# EAGLE design Micro (EAGLE 8.0.0)
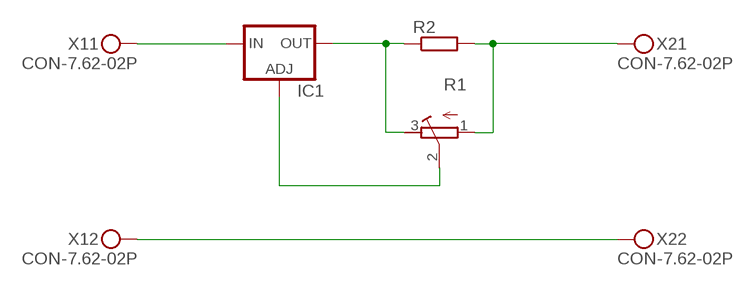
[diagram p0: schematic, sheet 1]

## Parts
IC1  LM350T  [317TS]
R1  R_POTE  [EVUE]
R2  R_SQP-5  [SQP-5]
X1  CON-7.62-02P  [KF25C-7.62-02P-13]
X2  CON-7.62-02P  [KF25C-7.62-02P-13]

## Nets
N$1: IC1.2(OUT) R1.3(E) R2.1
N$2: R1.1(A) R2.2 X2.P$1
N$3: IC1.1(ADJ) R1.2(S)
N$4: X1.P$2 X2.P$2
N$5: IC1.3(IN) X1.P$1

## Library data of the parts
IC1 = Namenlos:LM350T: VOLTAGE REGULATOR
R1 = Namenlos:R_POT
R2 = Namenlos:R_
X1 X2 = Namenlos:CON-7.62-02P

## Board
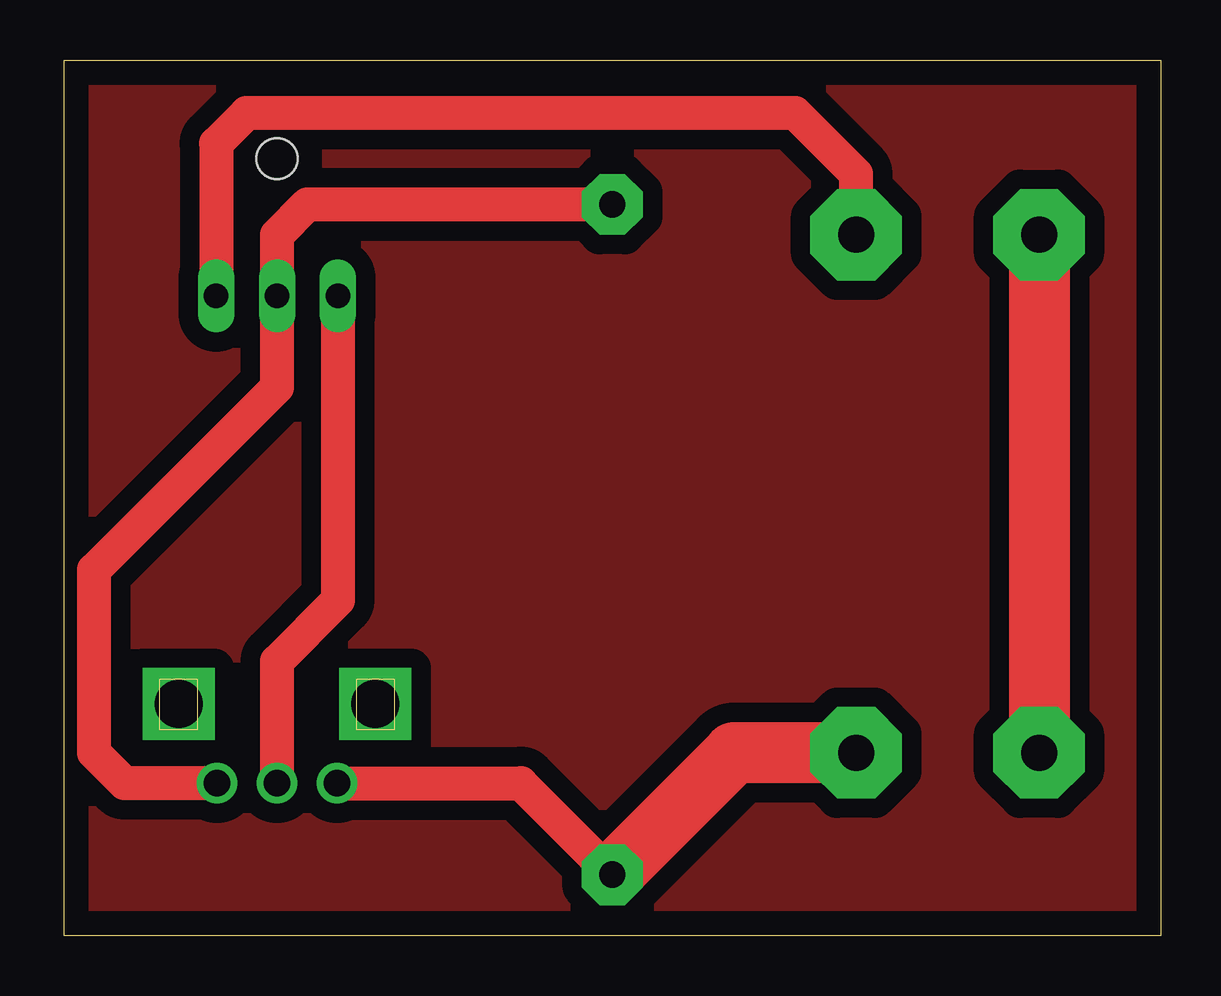
[diagram p1: board, top side]
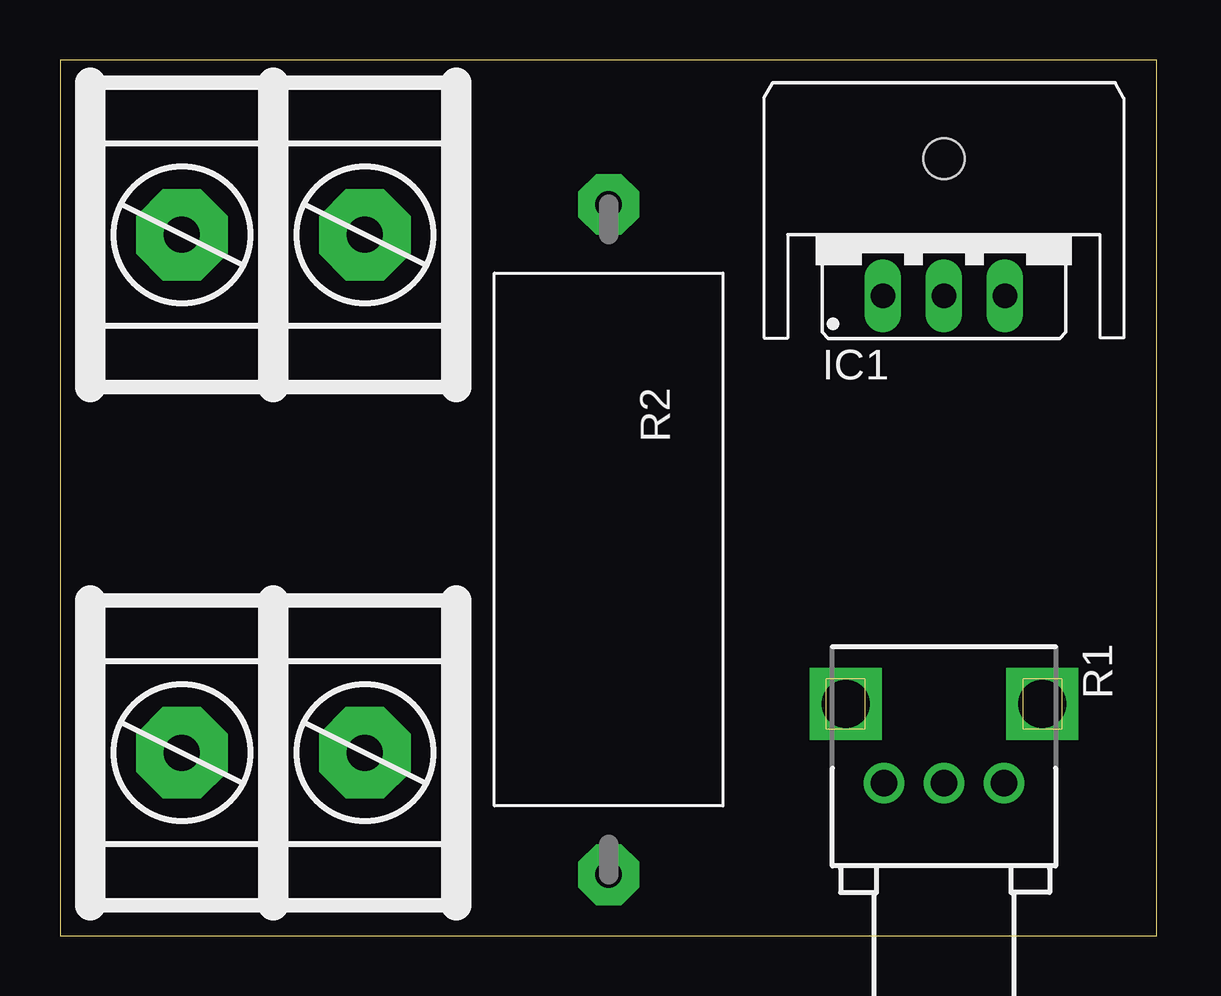
[diagram p2: board, bottom side, seen from below]

Size 45.7 x 36.5 mm. Coordinates in mm from the lower left corner, seen from the top.
Outline: 45.7,0 0,0 0,36.5 45.7,36.5 45.7,0
Copper layers (1*16): Top 0.035mm / dielectric 1.5mm / Bottom 0.035mm
Design rules "default": minimum track width 10mil, minimum drill 24mil, track to track 8mil, track to pad 8mil, pad to pad 8mil, via to via 8mil, smd to smd 8mil, copper to edge 40mil, drill to drill 8mil, minimum pad ring 10mil, minimum via ring 8mil, stop-mask expansion 4mil, vias tented up to drill 0mil, thermal gap 10mil

### Footprints (pad centres in the part's own frame; a part is rotated, then mirrored left to right if it is on the bottom)
317TS = drill 1.016 long: 1 -2.54,-2.54; 2 0,-2.54; 3 2.54,-2.54
EVUE = drill 1.1 pad 1.676: 1 0,-2.5; 2 0,0; 3 0,2.5 | drill 2 pad 2.8 square: M1 -3.3,4.1; M2 -3.3,-4.1
SQP-5 = drill 1.1 pad 2.54 octagon: 1 -13.97,0; 2 13.97,0
SK95-3M3_HOLE = hole 1.7: 0,3.175
KF25C-7.62-02P-13 = drill 1.5 pad 3.81 octagon: P$1 -3.81,0; P$2 3.81,0

### Placement (x,y rotation side)
IC1  8.87,29.21 0 bottom
R1  8.87,6.35 270 bottom
R2  22.84,16.51 270 bottom
U$1  [SK95-3M3_HOLE]  8.87,29.21 0 bottom
X1  36.81,29.21 180 bottom
X2  36.81,7.62 180 bottom

### Tracks (layer width: path | path; a pad name or v marks a point on that pad's centre or on a via)
N$1
  Top 1.422: R2.1 10.14,30.48 8.87,29.21 IC1.2 8.87,22.86 1.25,15.24 1.25,7.62 2.52,6.35 R1.3
N$2
  Top 1.422: R2.2 19.03,6.35 R1.1
  Top 2.54: X2.P$1 27.92,7.62 R2.2
N$3
  Top 1.422: IC1.1 11.41,13.97 8.87,11.43 R1.2
N$4
  Top 2.54: X1.P$2 X2.P$2
N$5
  Top 1.422: X1.P$1 33,31.75 30.46,34.29 7.6,34.29 6.33,33.02 IC1.3
N$6
  pour Top (isolate 0.813): 45.7,0 -0.02,0 -0.02,36.83 45.7,36.83